# EAGLE design SID-Monitor (EAGLE 8.5.1)

## Sheet 1 of 2
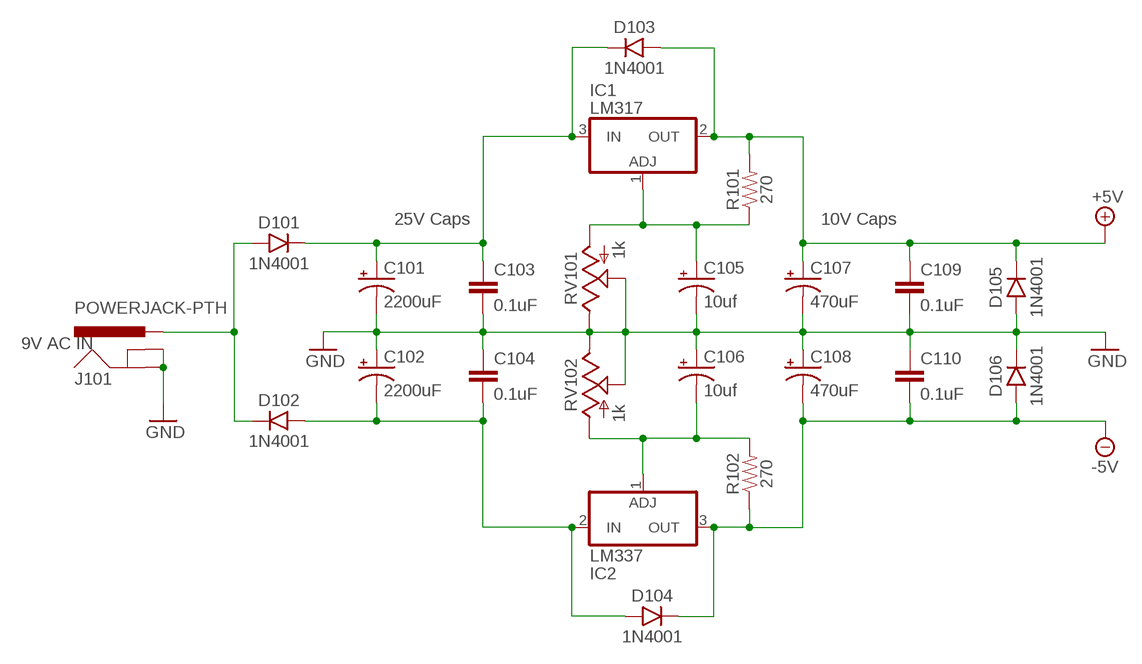
[diagram p0: schematic, sheet 1]

### Parts
C101  2200uF  CAPACITOR-POLARIZED-5-13  [CAP-POL-5-13]
C102  2200uF  CAPACITOR-POLARIZED-5-13  [CAP-POL-5-13]
C103  0.1uF  CAPACITOR-2.5MM  [CAPACITOR-2.5MM]
C104  0.1uF  CAPACITOR-2.5MM  [CAPACITOR-2.5MM]
C105  10uf  CAPACITOR-POLARIZED-2.5-5  [CAP-POL-2.5-5]
C106  10uf  CAPACITOR-POLARIZED-2.5-5  [CAP-POL-2.5-5]
C107  470uF  CAPACITOR-POLARIZED-3.5-8  [CAP-POL-3.5-8]
C108  470uF  CAPACITOR-POLARIZED-3.5-8  [CAP-POL-3.5-8]
C109  0.1uF  CAPACITOR-2.5MM  [CAPACITOR-2.5MM]
C110  0.1uF  CAPACITOR-2.5MM  [CAPACITOR-2.5MM]
D101  1N4001  DIODE-1N4001  [DO-41]
D102  1N4001  DIODE-1N4001  [DO-41]
D103  1N4001  DIODE-1N4001  [DO-41]
D104  1N4001  DIODE-1N4001  [DO-41]
D105  1N4001  DIODE-1N4001  [DO-41]
D106  1N4001  DIODE-1N4001  [DO-41]
IC1  LM317  [TO220BV]
IC2  LM337  [TO220BV]
J101  POWERJACK-PTH  [POWER_JACK_PTH]
R101  270  RESISTOR-7.5MM  [AXIAL-7.5MM]
R102  270  RESISTOR-7.5MM  [AXIAL-7.5MM]
RV101  1k  POTTRIM  [TRIM_POT]
RV102  1k  POTTRIM  [TRIM_POT]

### Nets
+5V: C107.+ C109.1 D103.1(+) D105.2(-) IC1.2(OUT) R101.P$2 ; also sheet 2
-5V: C108.- C110.2 D104.2(-) D106.1(+) IC2.3(OUT) R102.P$1 ; also sheet 2
GND: C101.- C102.+ C103.2 C104.1 C105.- C106.+ C107.- C108.+ C109.2 C110.1 D105.1(+) D106.2(-) J101.GND J101.GNDBREAK RV101.1(S) RV101.2(E) RV102.1(S) RV102.2(E) ; also sheet 2
N$1: C102.- C104.2 D102.1(+) D104.1(+) IC2.2(IN)
N$2: C101.+ C103.1 D101.2(-) D103.2(-) IC1.3(IN)
N$4: D101.1(+) D102.2(-) J101.PWR
N$61: C105.+ IC1.1(ADJ) R101.P$1 RV101.3(A)
N$63: C106.- IC2.1(ADJ) R102.P$2 RV102.3(A)

### Notes on the sheet
- 25V Caps | 10V Caps
- 9V AC IN

## Sheet 2 of 2
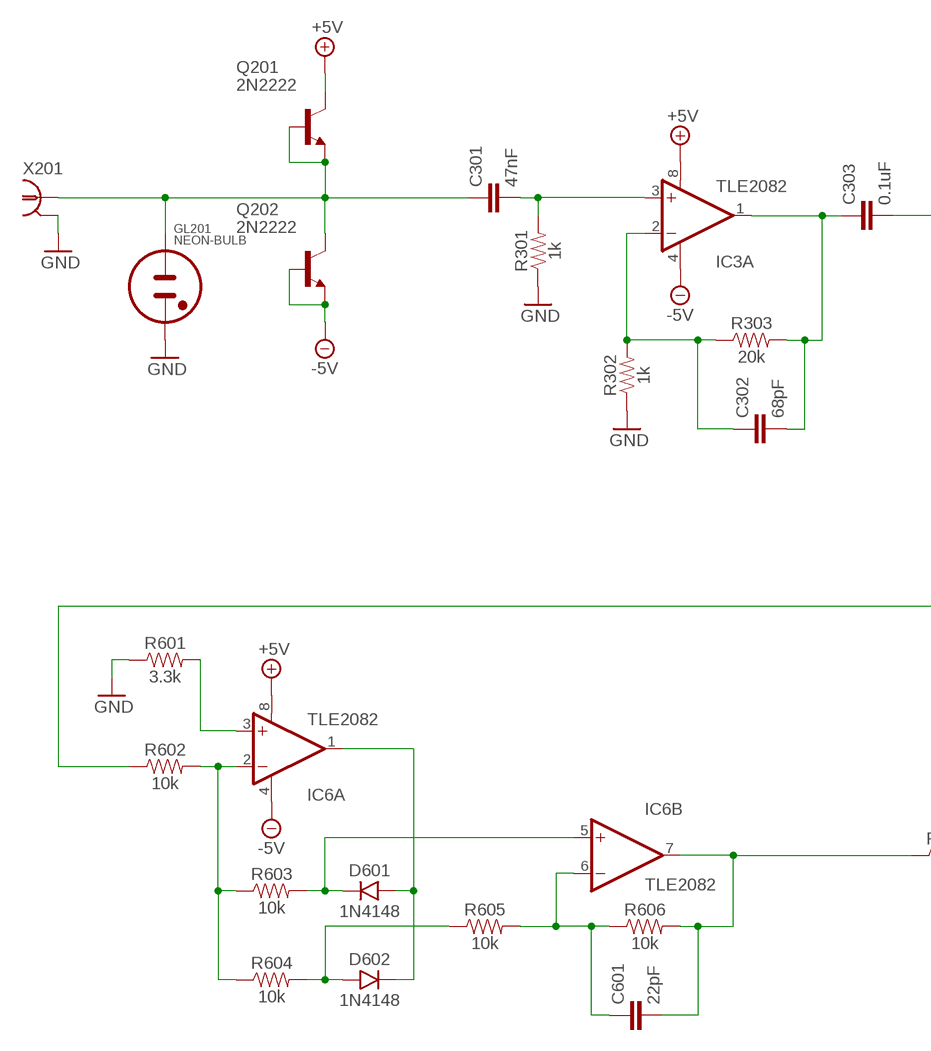
[diagram p1: schematic, sheet 2, part 1 of 2]
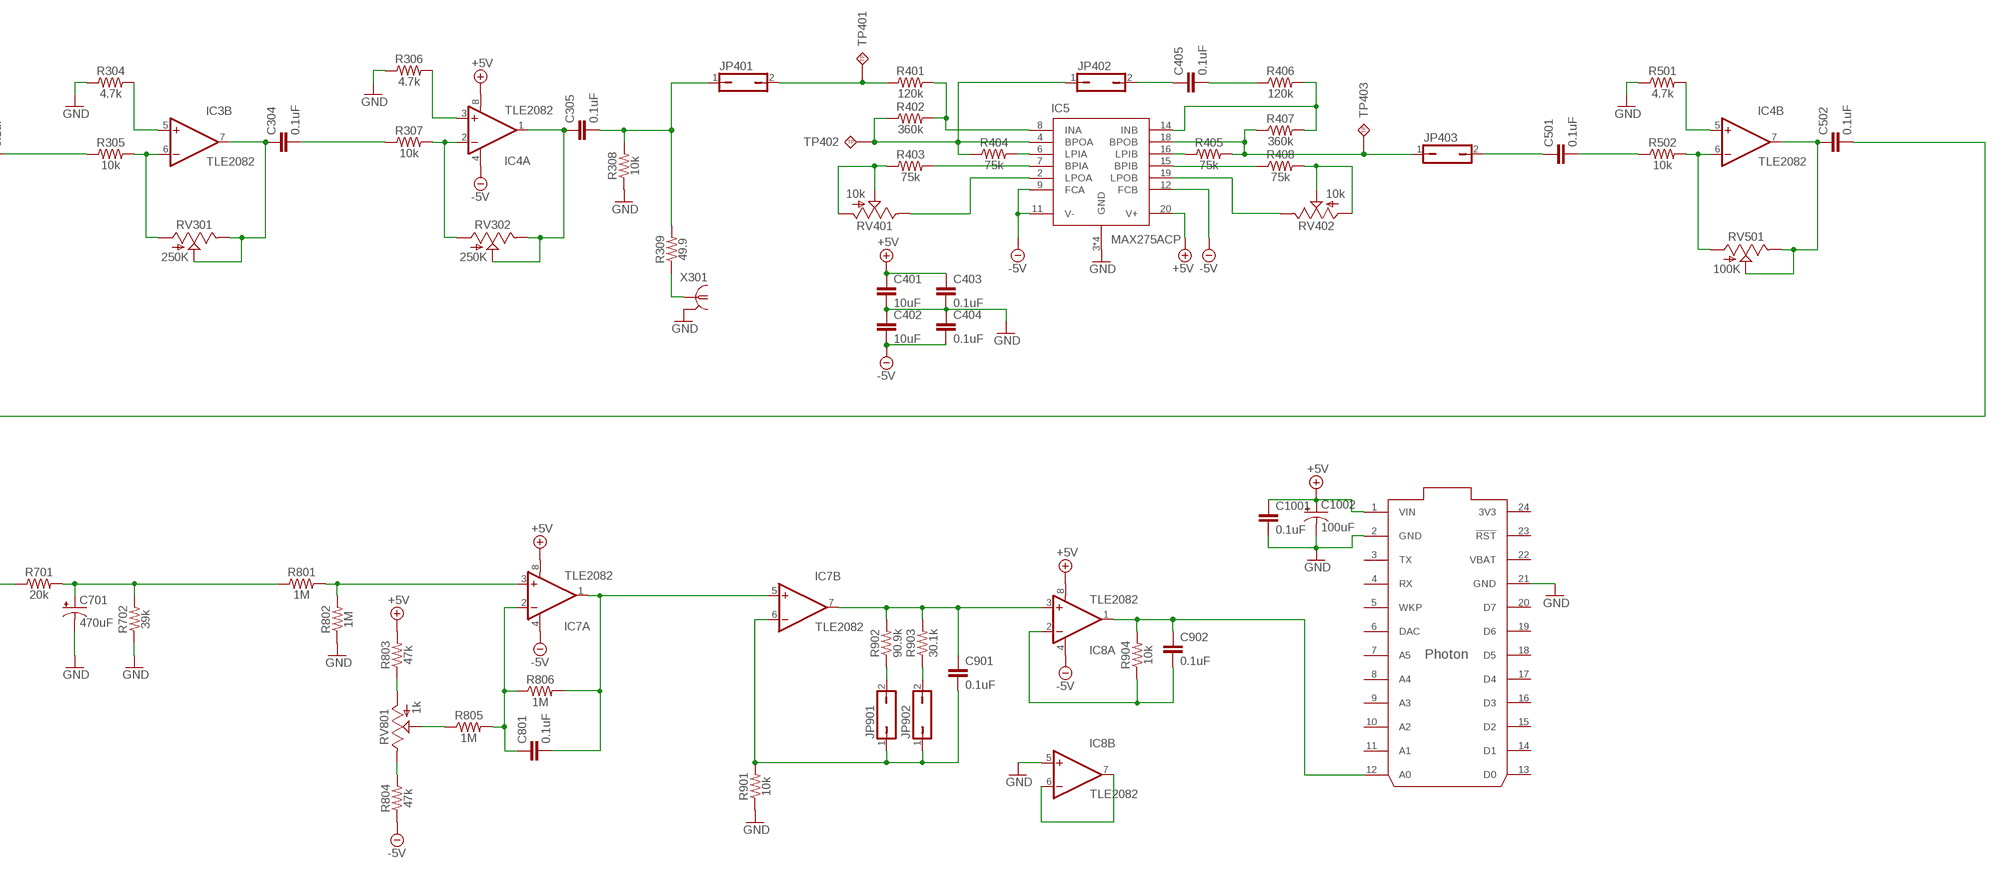
[diagram p2: schematic, sheet 2, part 2 of 2]

### Parts
C301  47nF  CAPACITOR-2.5MM  [CAPACITOR-2.5MM]
C302  68pF  CAPACITOR-2.5MM  [CAPACITOR-2.5MM]
C303  0.1uF  CAPACITOR-2.5MM  [CAPACITOR-2.5MM]
C304  0.1uF  CAPACITOR-2.5MM  [CAPACITOR-2.5MM]
C305  0.1uF  CAPACITOR-2.5MM  [CAPACITOR-2.5MM]
C401  10uF  CAPACITOR-5MM  [CAPACITOR-5MM]
C402  10uF  CAPACITOR-5MM  [CAPACITOR-5MM]
C403  0.1uF  CAPACITOR-2.5MM  [CAPACITOR-2.5MM]
C404  0.1uF  CAPACITOR-2.5MM  [CAPACITOR-2.5MM]
C405  0.1uF  CAPACITOR-2.5MM  [CAPACITOR-2.5MM]
C501  0.1uF  CAPACITOR-2.5MM  [CAPACITOR-2.5MM]
C502  0.1uF  CAPACITOR-2.5MM  [CAPACITOR-2.5MM]
C601  22pF  CAPACITOR-2.5MM  [CAPACITOR-2.5MM]
C701  470uF  CAPACITOR-POLARIZED-3.5-8  [CAP-POL-3.5-8]
C801  0.1uF  CAPACITOR-2.5MM  [CAPACITOR-2.5MM]
C901  0.1uF  CAPACITOR-2.5MM  [CAPACITOR-2.5MM]
C902  0.1uF  CAPACITOR-2.5MM  [CAPACITOR-2.5MM]
C1001  0.1uF  CAPACITOR-2.5MM  [CAPACITOR-2.5MM]
C1002  100uF  CAPACITOR-POLARIZED-3.5-8  [CAP-POL-3.5-8]
D601  1N4148  DIODE-1N4148  [DIODE-DO-35]
D602  1N4148  DIODE-1N4148  [DIODE-DO-35]
GL201  NEON-BULB  [NEON-BULB]
IC3  TLE2082  [DIP08]
IC4  TLE2082  [DIP08]
IC5  MAX275ACP  [DIP20]
IC6  TLE2082  [DIP08]
IC7  TLE2082  [DIP08]
IC8  TLE2082  [DIP08]
IC9  PHOTON  PHOTON_WITH_HEADERS  [PHOTON]
JP401  JUMPER1  [JUMPER1]
JP402  JUMPER1  [JUMPER1]
JP403  JUMPER1  [JUMPER1]
JP901  JUMPER1  [JUMPER1]
JP902  JUMPER1  [JUMPER1]
Q201  2N2222  [TO92-INLINE]
Q202  2N2222  [TO92-INLINE]
R301  1k  RESISTOR-7.5MM  [AXIAL-7.5MM]
R302  1k  RESISTOR-7.5MM  [AXIAL-7.5MM]
R303  20k  RESISTOR-7.5MM  [AXIAL-7.5MM]
R304  4.7k  RESISTOR-7.5MM  [AXIAL-7.5MM]
R305  10k  RESISTOR-7.5MM  [AXIAL-7.5MM]
R306  4.7k  RESISTOR-7.5MM  [AXIAL-7.5MM]
R307  10k  RESISTOR-7.5MM  [AXIAL-7.5MM]
R308  10k  RESISTOR-7.5MM  [AXIAL-7.5MM]
R309  49.9  RESISTOR-7.5MM  [AXIAL-7.5MM]
R401  120k  RESISTOR-7.5MM  [AXIAL-7.5MM]
R402  360k  RESISTOR-7.5MM  [AXIAL-7.5MM]
R403  75k  RESISTOR-7.5MM  [AXIAL-7.5MM]
R404  75k  RESISTOR-7.5MM  [AXIAL-7.5MM]
R405  75k  RESISTOR-7.5MM  [AXIAL-7.5MM]
R406  120k  RESISTOR-7.5MM  [AXIAL-7.5MM]
R407  360k  RESISTOR-7.5MM  [AXIAL-7.5MM]
R408  75k  RESISTOR-7.5MM  [AXIAL-7.5MM]
R501  4.7k  RESISTOR-7.5MM  [AXIAL-7.5MM]
R502  10k  RESISTOR-7.5MM  [AXIAL-7.5MM]
R601  3.3k  RESISTOR-7.5MM  [AXIAL-7.5MM]
R602  10k  RESISTOR-7.5MM  [AXIAL-7.5MM]
R603  10k  RESISTOR-7.5MM  [AXIAL-7.5MM]
R604  10k  RESISTOR-7.5MM  [AXIAL-7.5MM]
R605  10k  RESISTOR-7.5MM  [AXIAL-7.5MM]
R606  10k  RESISTOR-7.5MM  [AXIAL-7.5MM]
R701  20k  RESISTOR-7.5MM  [AXIAL-7.5MM]
R702  39k  RESISTOR-7.5MM  [AXIAL-7.5MM]
R801  1M  RESISTOR-7.5MM  [AXIAL-7.5MM]
R802  1M  RESISTOR-7.5MM  [AXIAL-7.5MM]
R803  47k  RESISTOR-7.5MM  [AXIAL-7.5MM]
R804  47k  RESISTOR-7.5MM  [AXIAL-7.5MM]
R805  1M  RESISTOR-7.5MM  [AXIAL-7.5MM]
R806  1M  RESISTOR-7.5MM  [AXIAL-7.5MM]
R901  10k  RESISTOR-7.5MM  [AXIAL-7.5MM]
R902  90.9k  RESISTOR-7.5MM  [AXIAL-7.5MM]
R903  30.1k  RESISTOR-7.5MM  [AXIAL-7.5MM]
R904  10k  RESISTOR-7.5MM  [AXIAL-7.5MM]
RV301  250K  POTTRIM  [TRIM_POT]
RV302  250K  POTTRIM  [TRIM_POT]
RV401  10k  POTTRIM  [TRIM_POT]
RV402  10k  POTTRIM  [TRIM_POT]
RV501  100K  POTTRIM  [TRIM_POT]
RV801  1k  POTTRIM  [TRIM_POT]
TP401  TESTPOINT-TH  [1X01]
TP402  TESTPOINT-TH  [1X01]
TP403  TESTPOINT-TH  [1X01]
X201  5414373  [5414373]
X301  5414373  [5414373]

### Nets
+5V: C401.1 C403.1 C1001.1 C1002.+ IC3.8(A:V+) IC4.8(A:V+) IC5.20(V+) IC6.8(A:V+) IC7.8(A:V+) IC8.8(A:V+) IC9.1(VIN) Q201.3(C) R803.P$2 ; also sheet 1
-5V: C402.2 C404.2 IC3.4(A:V-) IC4.4(A:V-) IC5.9(FCA) IC5.11(V-) IC5.12(FCB) IC6.4(A:V-) IC7.4(A:V-) IC8.4(A:V-) Q202.1(E) Q202.2(B) R804.P$1 ; also sheet 1
GND: C401.2 C402.1 C403.2 C404.1 C701.- C1001.2 C1002.- GL201.2(C) IC5.3(GND) IC5.5(GND) IC5.10(GND) IC5.17(GND) IC8.5(B:+IN) IC9.2(GND) IC9.21(GND) R301.P$1 R302.P$1 R304.P$1 R306.P$1 R308.P$1 R501.P$1 R601.P$1 R702.P$1 R802.P$1 R901.P$1 X201.1 X201.2 X301.1 X301.2 ; also sheet 1
N$3: C301.1 GL201.1(A) Q201.1(E) Q201.2(B) Q202.3(C) X201.3
N$5: C301.2 IC3.3(A:+IN) R301.P$2
N$6: C302.1 IC3.2(A:-IN) R302.P$2 R303.P$1
N$7: C303.2 R305.P$1
N$8: C302.2 C303.1 IC3.1(A:OUT) R303.P$2
N$9: IC3.6(B:-IN) R305.P$2 RV301.3(A)
N$10: IC3.5(B:+IN) R304.P$2
N$11: C305.2 JP401.1 R308.P$2 R309.P$2
N$12: IC5.6(LPIA) R404.P$2
N$13: C304.1 IC3.7(B:OUT) RV301.1(S) RV301.2(E)
N$14: C304.2 R307.P$1
N$15: IC4.2(A:-IN) R307.P$2 RV302.3(A)
N$16: IC4.3(A:+IN) R306.P$2
N$17: C305.1 IC4.1(A:OUT) RV302.1(S) RV302.2(E)
N$18: IC5.4(BPOA) JP402.1 R402.P$1 R404.P$1 TP402.1(KL)
N$19: IC5.8(INA) R401.P$2 R402.P$2
N$20: JP401.2 R401.P$1 TP401.1(KL)
N$21: IC5.7(BPIA) R403.P$2
N$22: R403.P$1 RV401.1(S) RV401.3(A)
N$23: IC5.2(LPOA) RV401.2(E)
N$24: C405.1 JP402.2
N$25: C405.2 R406.P$1
N$26: IC5.16(LPIB) R405.P$1
N$27: IC5.14(INB) R406.P$2 R407.P$2
N$28: IC5.18(BPOB) JP403.1 R405.P$2 R407.P$1 TP403.1(KL)
N$29: C501.2 R502.P$1
N$30: IC5.15(BPIB) R408.P$1
N$31: R408.P$2 RV402.1(S) RV402.3(A)
N$32: IC5.19(LPOB) RV402.2(E)
N$33: IC4.6(B:-IN) R502.P$2 RV501.3(A)
N$34: IC4.5(B:+IN) R501.P$2
N$35: C502.1 IC4.7(B:OUT) RV501.1(S) RV501.2(E)
N$36: C502.2 R602.P$1
N$37: C501.1 JP403.2
N$38: R309.P$1 X301.3
N$39: IC8.6(B:-IN) IC8.7(B:OUT)
N$41: R803.P$1 RV801.3(A)
N$42: IC6.2(A:-IN) R602.P$2 R603.P$1 R604.P$1
N$43: IC6.3(A:+IN) R601.P$2
N$44: D601.A(+) D602.C(-) IC6.1(A:OUT)
N$45: D601.C(-) IC6.5(B:+IN) R603.P$2
N$46: D602.A(+) R604.P$2 R605.P$1
N$47: C701.+ R701.P$2 R702.P$2 R801.P$1
N$48: C601.2 IC6.7(B:OUT) R606.P$2 R701.P$1
N$49: C601.1 IC6.6(B:-IN) R605.P$2 R606.P$1
N$50: R804.P$2 RV801.2(E)
N$51: R805.P$1 RV801.1(S)
N$52: C801.1 IC7.2(A:-IN) R805.P$2 R806.P$1
N$53: IC7.3(A:+IN) R801.P$2 R802.P$2
N$54: C801.2 IC7.1(A:OUT) IC7.5(B:+IN) R806.P$2
N$55: C901.1 IC7.7(B:OUT) IC8.3(A:+IN) R902.P$2 R903.P$2
N$56: JP902.2 R903.P$1
N$57: JP901.2 R902.P$1
N$58: C901.2 IC7.6(B:-IN) JP901.1 JP902.1 R901.P$2
N$59: C902.1 IC8.1(A:OUT) IC9.12(A0) R904.P$2
N$60: C902.2 IC8.2(A:-IN) R904.P$1
Unconnected: IC9.3(TX) IC9.4(RX) IC9.5(WKP) IC9.6(DAC) IC9.7(A5) IC9.8(A4) IC9.9(A3) IC9.10(A2) IC9.11(A1) IC9.13(D0) IC9.14(D1) IC9.15(D2) IC9.16(D3) IC9.17(D4) IC9.18(D5) IC9.19(D6) IC9.20(D7) IC9.23(!RST)

## Power pins joined to a net without a drawn wire
3V3: IC9.24(3V3)
VBAT: IC9.22(VBAT)

## Library data of the parts
C101 C102 C105-C108 C701 C1002 = SaintGimp:CAPACITOR-POLARIZED: Polarized Capacitor
C103 C104 C109 C110 C301-C305 C401-C405 C501 C502 C601 C801 C901 C902 C1001 = SaintGimp:CAPACITOR: Ceramic Capacitor
D101-D106 D601 D602 = SaintGimp:DIODE
GL201 = SaintGimp:NEON-BULB
IC1 = SaintGimp:LM317: Adjustable voltage regulator
IC2 = SaintGimp:LM337: Adjustable negative voltage regulator
IC3 IC4 IC6-IC8 = SaintGimp:TLE2082: Dual-supply dual opamp
IC5 = SaintGimp:MAX275
IC9 = SaintGimp:PHOTON
J101 = SaintGimp:POWERJACK
JP401-JP403 JP901 JP902 = SaintGimp:JUMPER1: JUMPER
Q201 Q202 = SaintGimp:2N2222
R101 R102 R301-R309 R401-R408 R501 R502 R601-R606 R701 R702 R801-R806 R901-R904 = SaintGimp:RESISTOR-*
RV101 RV102 RV301 RV302 RV401 RV402 RV501 RV801 = SaintGimp:POT
TP401-TP403 = SaintGimp:TESTPOINT-*
X201 X301 = SaintGimp:5414373: BNC Connector

## Board
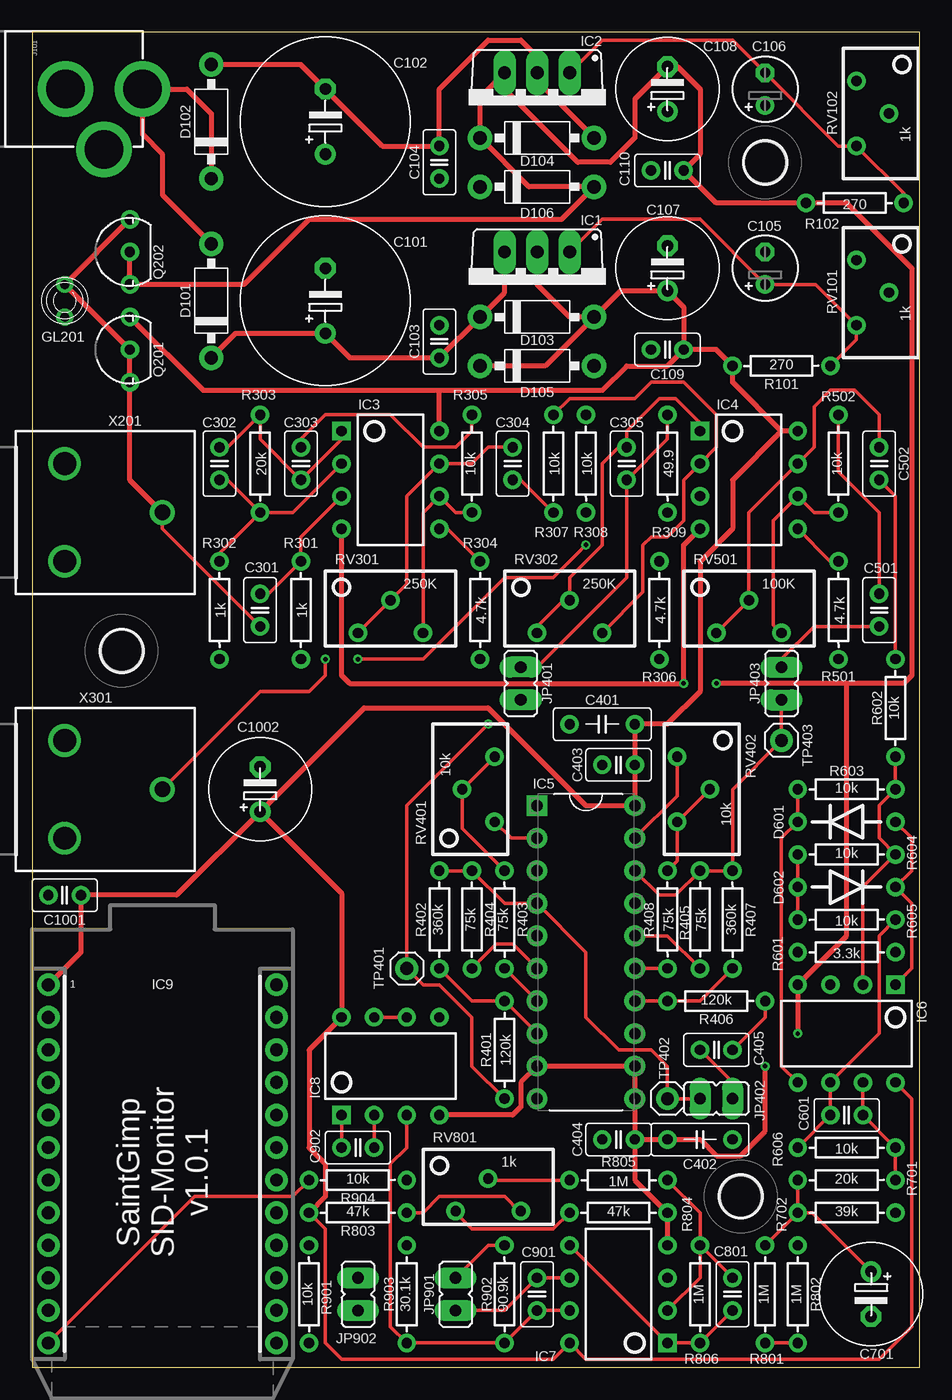
[diagram p3: board, top side]
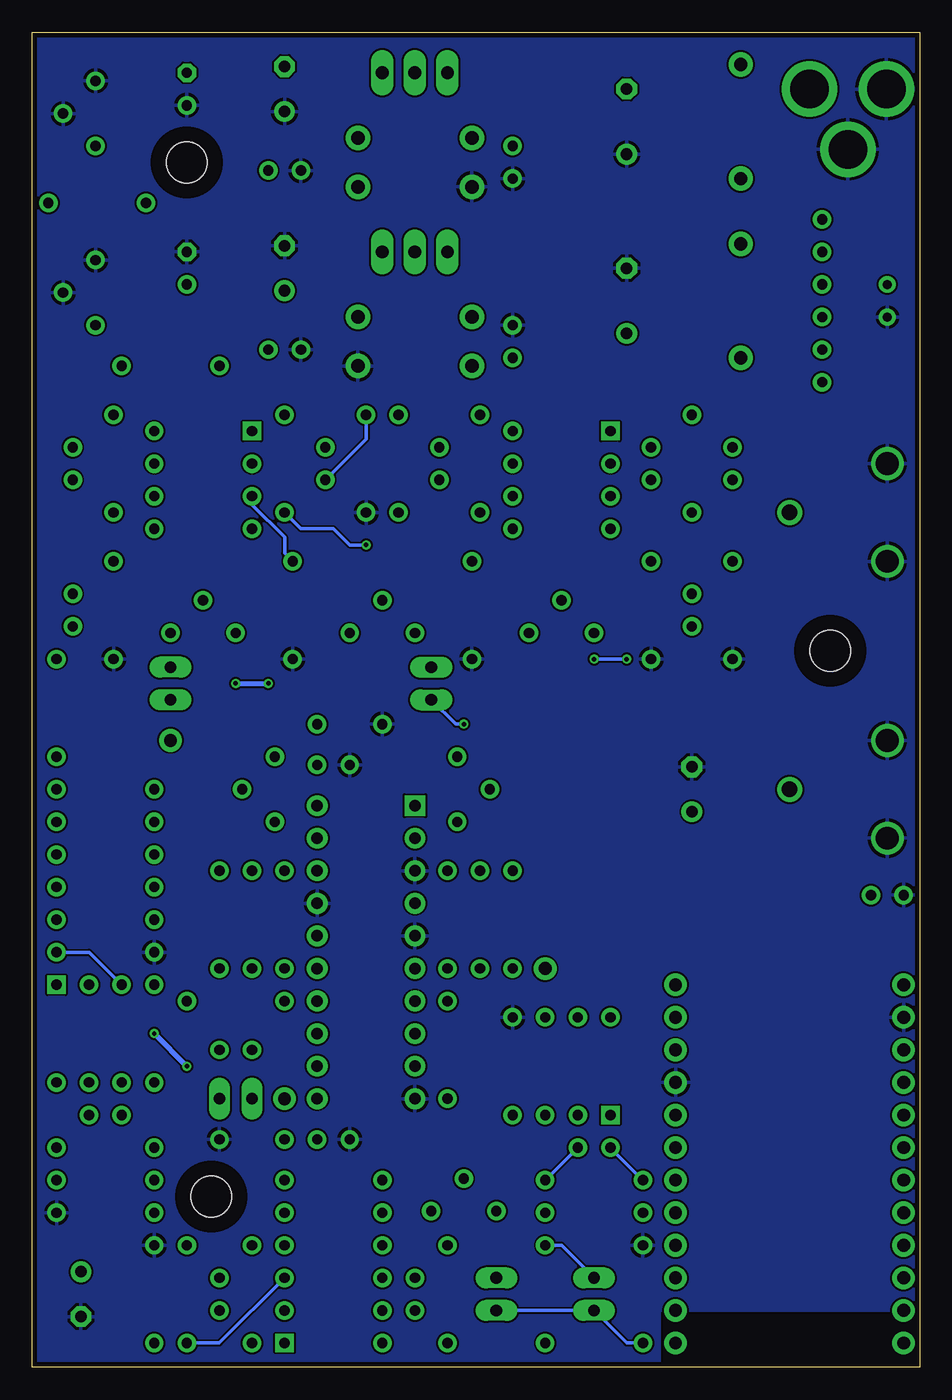
[diagram p4: board, bottom side, seen from below]

Size 69.22 x 104.14 mm. Coordinates in mm from the lower left corner, seen from the top.
Outline: 0,0 69.22,0 69.22,104.14 0,104.14 0,0
Copper layers (1*16): Top 0.0356mm / dielectric 1.5011mm / Bottom 0.0356mm
Design rules "Saintgimp-OSHPark *": minimum track width 10mil, minimum drill 13mil, track to track 6mil, track to pad 6mil, pad to pad 6mil, via to via 6mil, smd to smd 6mil, copper to edge 15mil, drill to drill 6mil, minimum pad ring 12mil, minimum via ring 7mil, stop-mask expansion 2mil, vias tented up to drill 24mil, thermal gap 10mil

### Footprints (pad centres in the part's own frame; a part is rotated, then mirrored left to right if it is on the bottom)
CAP-POL-5-13 = drill 0.9: + -2.54,0 | drill 0.9 octagon: - 2.54,0
CAPACITOR-2.5MM = drill 0.8: 1 -1.27,0; 2 1.27,0
CAP-POL-2.5-5 = drill 0.8: + -1.27,0 | drill 0.8 octagon: - 1.27,0
CAP-POL-3.5-8 = drill 0.9: + -1.75,0 | drill 0.9 octagon: - 1.75,0
CAPACITOR-5MM = drill 0.8: 1 -2.54,0; 2 2.54,0
DO-41 = drill 1.041 pad 1.905: 1 -4.445,0; 2 4.445,0
DIODE-DO-35 = drill 0.8: A 3.81,0; C -3.81,0
NEON-BULB = drill 0.7: 1 0,1.27; 2 0,-1.27
TO220BV = drill 1 long: 1 -2.54,-2.54; 2 0,-2.54; 3 2.54,-2.54
DIP08 = drill 0.8 square: 1 -3.81,-3.81 | drill 0.8: 2 -1.27,-3.81; 3 1.27,-3.81; 4 3.81,-3.81; 5 3.81,3.81; 6 1.27,3.81; 7 -1.27,3.81; 8 -3.81,3.81
DIP20 = drill 0.9 square: 1 -3.81,11.43 | drill 0.9: 2 -3.81,8.89; 3 -3.81,6.35; 4 -3.81,3.81; 5 -3.81,1.27; 6 -3.81,-1.27; 7 -3.81,-3.81; 8 -3.81,-6.35; 9 -3.81,-8.89; 10 -3.81,-11.43; 11 3.81,-11.43; 12 3.81,-8.89; 13 3.81,-6.35; 14 3.81,-3.81; 15 3.81,-1.27; 16 3.81,1.27; 17 3.81,3.81; 18 3.81,6.35; 19 3.81,8.89; 20 3.81,11.43
PHOTON = drill 1: 1 -8.89,13.97; 2 -8.89,11.43; 3 -8.89,8.89; 4 -8.89,6.35; 5 -8.89,3.81; 6 -8.89,1.27; 7 -8.89,-1.27; 8 -8.89,-3.81; 9 -8.89,-6.35; 10 -8.89,-8.89; 11 -8.89,-11.43; 12 -8.89,-13.97; 13 8.89,-13.97; 14 8.89,-11.43; 15 8.89,-8.89; 16 8.89,-6.35; 17 8.89,-3.81; 18 8.89,-1.27; 19 8.89,1.27; 20 8.89,3.81; 21 8.89,6.35; 22 8.89,8.89; 23 8.89,11.43; 24 8.89,13.97
POWER_JACK_PTH = drill 2.997 pad 4.318: GND 0,7.7; GNDBREAK 4.7,10.7; PWR 0,13.7
JUMPER1 = drill 0.914 long: 1 0,-1.27; 2 0,1.27
TO92-INLINE = drill 0.8: 1 -2.54,0; 2 0,0; 3 2.54,0
AXIAL-7.5MM = drill 0.8: P$1 -3.81,0; P$2 3.81,0
TRIM_POT = drill 0.8: 1 0,0.762; 2 -2.54,-1.778; 3 2.54,-1.778
1X01 = drill 1: 1 0,0
MOUNTING-HOLE-3.2MM = hole 3.2: 0,0
5414373 = drill 1.778: 1 -3.81,0; 2 3.81,0 | drill 1.194: 3 0,-7.62

### Placement (x,y rotation side)
C101  22.86,83.19 90 top
C102  22.86,97.16 90 top
C103  31.75,80.01 90 top
C104  31.75,93.98 90 top
C105  57.15,85.72 90 top
C106  57.15,99.69 90 top
C107  49.53,85.72 90 top
C108  49.53,99.69 90 top
C109  49.53,79.38 180 top
C110  49.53,93.34 0 top
C301  17.78,59.05 90 top
C302  14.61,70.48 90 top
C303  20.95,70.48 90 top
C304  37.47,70.48 270 top
C305  46.35,70.48 270 top
C401  44.45,50.16 180 top
C402  52.07,17.78 180 top
C403  45.72,46.99 180 top
C404  45.72,17.78 0 top
C405  53.34,24.77 0 top
C501  66.04,59.05 90 top
C502  66.04,70.48 270 top
C601  63.5,19.68 0 top
C701  65.41,5.71 270 top
C801  54.61,5.71 270 top
C901  39.37,5.71 90 top
C902  25.4,17.14 0 top
C1001  2.54,36.83 180 top
C1002  17.78,45.09 90 top
D101  13.97,83.19 270 top
D102  13.97,97.16 270 top
D103  39.37,81.92 180 top
D104  39.37,95.89 180 top
D105  39.37,78.11 180 top
D106  39.37,92.08 180 top
D601  63.5,42.55 0 top
D602  63.5,37.47 180 top
GL201  2.54,83.19 0 top
IC1  39.37,84.45 180 top
IC2  39.37,98.42 180 top
IC3  27.94,69.22 270 top
IC4  55.88,69.22 270 top
IC5  43.18,32.38 0 top
IC6  63.5,26.04 180 top
IC7  45.72,5.71 90 top
IC8  27.94,23.5 0 top
IC9  10.16,15.88 0 top
J101  -5.08,99.69 270 top
JP401  38.1,53.34 180 top
JP402  53.34,20.95 270 top
JP403  58.42,53.34 0 top
JP901  33.02,5.71 0 top
JP902  25.4,5.71 0 top
Q201  7.62,79.38 90 top
Q202  7.62,87 90 top
R101  58.42,78.11 180 top
R102  64.14,90.81 0 top
R301  20.95,59.05 90 top
R302  14.61,59.05 90 top
R303  17.78,70.48 90 top
R304  34.92,59.05 90 top
R305  34.29,70.48 270 top
R306  48.9,59.05 90 top
R307  40.64,70.48 90 top
R308  43.18,70.48 90 top
R309  49.53,70.48 90 top
R401  36.83,24.77 90 top
R402  31.75,34.92 270 top
R403  36.83,34.92 270 top
R404  34.29,34.92 270 top
R405  52.07,34.92 90 top
R406  53.34,28.57 180 top
R407  54.61,34.92 270 top
R408  49.53,34.92 90 top
R501  62.87,59.05 90 top
R502  62.87,70.48 270 top
R601  63.5,32.38 0 top
R602  67.31,51.44 270 top
R603  63.5,45.09 180 top
R604  63.5,40.01 180 top
R605  63.5,34.92 0 top
R606  63.5,17.14 0 top
R701  63.5,14.61 180 top
R702  63.5,12.06 180 top
R801  57.15,5.71 270 top
R802  59.69,5.71 270 top
R803  25.4,12.06 180 top
R804  45.72,12.06 180 top
R805  45.72,14.61 0 top
R806  52.07,5.71 270 top
R901  21.59,5.71 270 top
R902  36.83,5.71 270 top
R903  29.21,5.71 270 top
R904  25.4,14.61 180 top
RV101  66.04,83.82 270 top
RV102  66.04,97.79 270 top
RV301  27.94,59.05 0 top
RV302  41.91,59.05 0 top
RV401  34.29,45.09 90 top
RV402  52.07,45.09 270 top
RV501  55.88,59.05 0 top
RV801  35.56,13.97 0 top
TP401  29.21,31.11 0 top
TP402  49.53,20.95 270 top
TP403  58.42,48.9 270 top
U$1  [MOUNTING-HOLE-3.2MM]  6.99,55.88 0 top
U$2  [MOUNTING-HOLE-3.2MM]  55.24,13.34 0 top
U$3  [MOUNTING-HOLE-3.2MM]  57.15,93.98 0 top
X201  2.54,66.67 90 top
X301  2.54,45.09 90 top

### Tracks (layer width: path | path; a pad name or v marks a point on that pad's centre or on a via)
+5V
  Top 0.254: R803.P$2 22.86,10.79 22.86,1.91 24.13,0.64 40.64,0.64 IC7.8 43.18,0.64 66.04,0.64 68.58,3.17 68.58,20.95 IC6.8
  Top 0.381: D103.1 45.88,83.97 C107.+ 50.8,82.7 C109.1 | D103.1 41.91,81.92 39.37,84.45 IC1.2 | C109.1 53.34,79.38 R101.P$2 54.61,76.83 58.42,73.03 | 31.75,76.2 44.45,76.2 46.35,78.11 49.53,78.11 C109.1 | 31.75,76.2 13.34,76.2 Q201.3 | IC3.8 31.75,76.2 | IC4.8 58.42,73.03 | 58.42,73.03 54.61,69.22 54.61,65.41 52.07,62.87 52.07,52.7 49.53,50.16 C401.1 C403.1 IC5.20 43.18,43.81 35.56,51.44 25.88,51.44 C1002.+ | C1002.+ 11.28,36.83 C1001.1 3.81,32.38 IC9.1 | C1002.+ 24.13,36.98 IC8.8 21.59,24.77 21.59,17.14 22.86,15.88 22.86,13.34 R803.P$2 | D103.1 40.01,78.11 D105.2
-5V  (via drill 0.35)
  Top 0.381: 63.5,53.34 67.94,53.34 68.58,53.98 68.58,85.72 63.5,90.81 R102.P$1 53.34,90.81 C110.2 52.07,94.61 52.07,99.69 50.32,101.44 C108.- 46.99,98.91 46.99,95.89 45.09,93.98 42.55,93.98 36.83,99.69 IC2.3 34.92,99.06 D104.2 38.73,92.08 D106.1 41.27,89.53 21.59,89.53 16.51,84.45 Q202.1 Q202.2 | IC3.4 24.13,53.98 24.77,53.34 v50.8,53.34 50.8,64.14 IC4.4 | 63.5,53.34 63.5,33.66 IC6.4 v59.69,26.04 | C404.2 IC5.11 IC5.12 IC5.9 38.1,22.23 38.1,20.32 37.47,19.68 IC8.4 | C404.2 C402.2 52.07,17.78 53.34,16.51 55.24,16.51 57.15,18.41 v57.15,23.5 | C404.2 46.99,14.61 R804.P$1 IC7.4 | 63.5,53.34 v53.34,53.34
  Bottom 0.381: v59.69,26.04 v57.15,23.5 | v53.34,53.34 v50.8,53.34
GND
  pour Bottom: 0,104.14 69.22,104.14 69.22,0 20.32,0 20.32,4.45 0,4.45
N$1
  Top 0.381: D104.1 39.37,100.33 IC2.2 39.37,102.23 38.1,103.5 35.56,103.5 31.75,99.69 C104.2 27.3,95.25 C102.- 20.95,101.6 D102.1
N$2
  Top 0.381: D101.2 15.88,80.64 C101.+ 24.77,78.74 C103.1 D103.2 36.83,83.82 IC1.3
N$3
  Top 0.254: X201.3 10.16,65.41 C301.1
  Top 0.381: Q202.3 GL201.1 Q201.2 Q201.1 7.62,69.22 X201.3
N$4
  Top 0.381: D101.1 10.16,91.44 10.16,94.61 8.62,96.16 J101.PWR 12.06,99.69 13.97,97.79 D102.2
N$5
  Top 0.254: IC3.3 20.95,64.77 R301.P$2 18.41,60.33 C301.2
N$6
  Top 0.254: R303.P$1 13.97,62.87 R302.P$2 | R303.P$1 15.24,69.22 C302.1 | R303.P$1 20.32,66.67 IC3.2
N$7
  Top 0.254: C303.2 20.95,72.39 22.86,74.3 27.94,74.3 30.48,71.75 33.02,71.75 34.29,73.03 R305.P$1
N$8
  Top 0.254: C302.2 15.24,71.75 R303.P$2 17.78,72.39 C303.1 24.13,72.39 IC3.1
N$9
  Top 0.254: R305.P$2 33.02,66.67 IC3.6 30.48,66.67 RV301.3
N$10
  Top 0.254: R304.P$2 32.38,65.41 IC3.5
N$11
  Top 0.254: R309.P$2 49.53,72.39 C305.2 46.35,61.59 39.37,54.61 JP401.1
  Bottom 0.254: C305.2 43.18,72.39 R308.P$2
N$12
  Top 0.254: R404.P$2 36.2,33.02 37.47,33.02 IC5.6
N$13
  Top 0.254: RV301.2 RV301.1 29.21,61.09 29.21,67.94 IC3.7 34.29,70.48 35.56,71.75 C304.1
N$14
  Top 0.254: C304.2 38.1,69.22 R307.P$1
N$15
  Top 0.254: R307.P$2 41.91,75.56 46.99,75.56 48.26,76.83 50.8,76.83 53.34,74.3 53.34,71.75 IC4.2 50.8,69.22 50.8,66.04 49.53,64.77 48.26,64.77 47.62,64.14 47.62,60.45 RV302.3
N$16
  Bottom 0.254: IC4.3 52.07,67.31 49.53,64.77 49.53,63.5 R306.P$2
N$17
  Top 0.254: IC4.1 52.07,73.66 50.16,75.56 48.9,75.56 46.35,73.03 C305.1 45.72,71.75 44.45,70.48 44.45,64.14 41.91,61.59 41.91,60.33 | 41.91,60.33 39.37,57.78 RV302.2 | 41.91,60.33 RV302.1
N$18
  Top 0.254: R402.P$1 R404.P$1 36.83,36.2 IC5.4 43.18,32.38 43.18,27.3 45.72,24.77 48.26,24.77 49.53,23.5 TP402.1 JP402.1
N$19
  Top 0.254: IC5.8 R401.P$2 34.29,28.57 R402.P$2
N$20  (via drill 0.35)
  Top 0.254: R401.P$1 34.29,23.5 34.29,27.3 31.75,29.84 30.48,29.84 TP401.1 29.21,43.81 v35.56,50.16
  Bottom 0.254: v35.56,50.16 36.2,50.16 JP401.2
N$21
  Top 0.254: R403.P$2 IC5.7
N$22
  Top 0.254: RV401.3 RV401.1 33.53,42.04 R403.P$1
N$23
  Top 0.254: RV401.2 37.34,41.27 IC5.2
N$24
  Top 0.254: C405.1 54.61,22.23 JP402.2
N$25
  Top 0.254: C405.2 57.15,27.3 R406.P$1
N$26
  Top 0.254: R405.P$1 49.53,33.66 IC5.16
N$27
  Top 0.254: IC5.14 R406.P$2 52.07,28.57 R407.P$2
N$28
  Top 0.254: IC5.18 48.9,36.83 50.16,36.83 R405.P$2 R407.P$1 54.61,45.09 TP403.1 JP403.1
N$29
  Top 0.254: R502.P$1 62.87,69.85 66.04,66.67 C501.2
N$30
  Top 0.254: R408.P$1 IC5.15
N$31
  Top 0.254: RV402.1 RV402.3 50.29,39.5 R408.P$2
N$32
  Top 0.254: RV402.2 50.29,44.58 IC5.19
N$33
  Top 0.254: R502.P$2 60.96,66.67 IC4.6 57.78,66.04 57.78,57.91 RV501.3
N$34
  Top 0.254: R501.P$2 62.23,62.87 IC4.5
N$35
  Top 0.254: RV501.2 RV501.1 55.88,66.67 IC4.7 60.96,71.75 60.96,74.93 62.23,76.2 64.14,76.2 66.04,74.3 C502.1
N$36
  Top 0.254: R602.P$1 67.31,67.94 C502.2
N$37
  Top 0.254: C501.1 60.96,57.78 58.42,55.24 JP403.2
N$38  (via drill 0.35)
  Top 0.254: v43.18,64.14 40.64,61.59 36.83,61.59 30.48,55.24 v25.4,55.24 | X301.3 17.78,52.7 21.59,52.7 22.86,53.98 v22.86,55.24
  Bottom 0.254: v43.18,64.14 44.45,64.14 45.72,65.41 48.26,65.41 R309.P$1 | v25.4,55.24 v22.86,55.24
N$39
  Top 0.254: IC8.6 IC8.7
N$41
  Top 0.254: R803.P$1 30.48,12.06 31.75,13.34 36.83,13.34 37.97,12.19 RV801.3
N$42
  Top 0.254: R602.P$2 R603.P$1 66.04,43.81 66.04,41.27 R604.P$1 64.77,37.47 IC6.2
N$43
  Bottom 0.254: R601.P$2 64.77,32.38 IC6.3
N$44
  Top 0.254: D601.A 68.58,41.27 68.58,38.73 D602.C 68.58,36.2 68.58,31.11 IC6.1
N$45
  Top 0.254: R603.P$2 D601.C 58.42,41.27 58.42,23.5 IC6.5
N$46
  Top 0.254: R604.P$2 D602.A R605.P$1
N$47
  Top 0.254: R701.P$2 R702.P$2 | R702.P$2 60.8,12.06 C701.+ | R702.P$2 R801.P$1
N$48
  Top 0.254: IC6.7 C601.2 R606.P$2 R701.P$1
N$49
  Top 0.254: R605.P$2 66.04,33.66 66.04,26.04 IC6.6 C601.1 R606.P$1
N$50
  Top 0.254: R804.P$2 40.64,10.79 34.29,10.79 33.02,12.06 RV801.2
N$51
  Top 0.254: RV801.1 35.69,14.61 R805.P$1
N$52
  Top 0.254: C801.1 R806.P$1 | IC7.2 52.07,6.99 R806.P$1 | R806.P$1 52.07,12.06 R805.P$2
N$53
  Top 0.254: R802.P$2 R801.P$2
  Bottom 0.254: R801.P$2 54.61,1.91 IC7.3
N$54
  Top 0.254: IC7.5 IC7.1 R806.P$2 C801.2
N$55
  Top 0.254: IC7.7 C901.1 R902.P$2 R903.P$2 27.94,3.17 27.94,15.88 29.21,17.14 IC8.3
N$56
  Bottom 0.254: JP902.2 27.94,9.53 R903.P$1
N$57
  Top 0.254: R902.P$1 35.56,9.53 JP901.2
N$58
  Top 0.254: IC7.6 C901.2 36.83,4.45 JP901.1
  Bottom 0.254: JP901.1 JP902.1 22.86,1.91 R901.P$2
N$59
  Top 0.254: C902.1 IC8.1 | R904.P$2 20.32,13.34 12.7,13.34 IC9.12
  Bottom 0.254: C902.1 R904.P$2
N$60
  Top 0.254: C902.2 IC8.2
  Bottom 0.254: R904.P$1 C902.2
N$61
  Top 0.254: IC1.1 44.45,89.53 52.07,89.53 C105.+ 61.09,84.45 RV101.3 64.26,80.14 R101.P$1
N$63
  Top 0.254: IC2.1 44.45,103.5 54.61,103.5 C106.- 62.87,95.25 RV102.3 67.94,91.57 R102.P$2

### Text on the board
tPlace: SaintGimp / SID-Monitor / v1.0.1